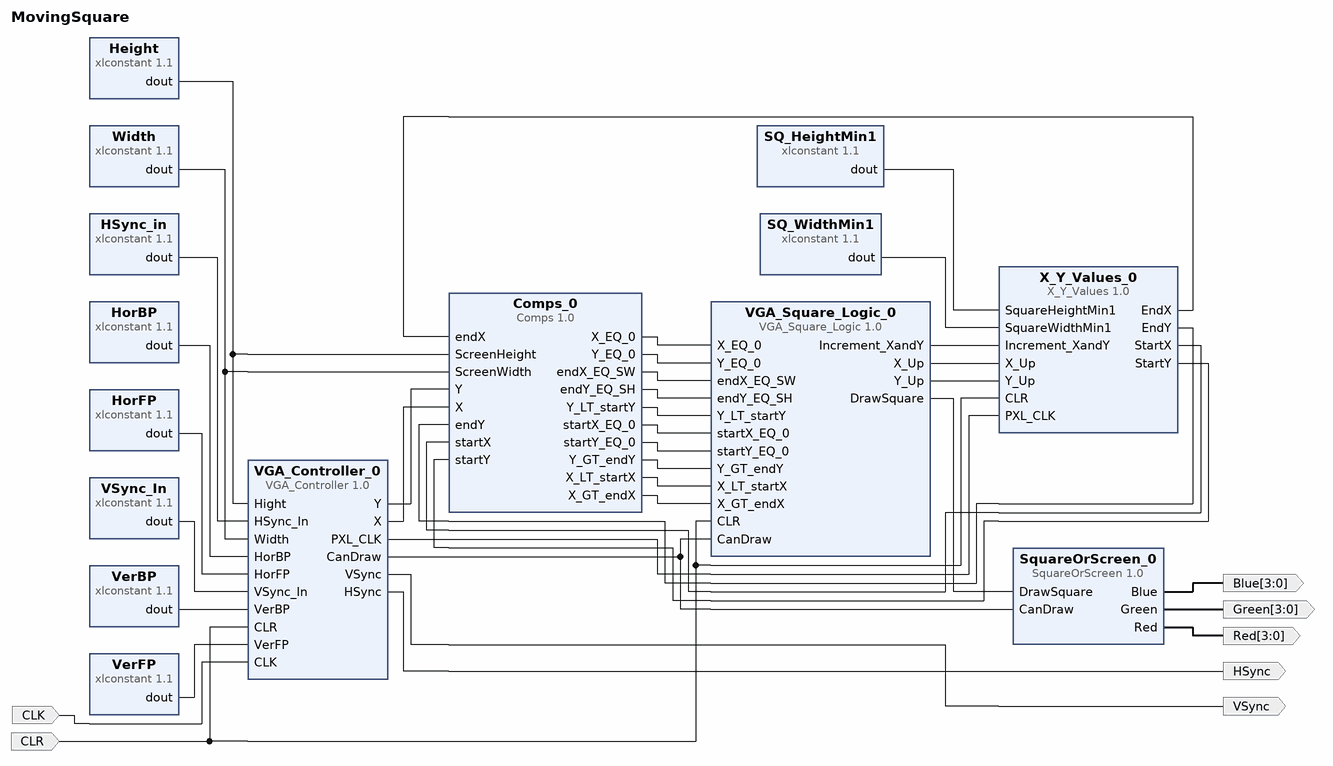
[diagram p0: block diagram of the top level]
# Vivado block design MovingSquare, xc7z020clg400-1, Vivado 2019.2
create_bd_design MovingSquare

create_bd_port -dir I -type clk CLK
set_property -dict {CONFIG.FREQ_HZ 125000000} [get_bd_ports CLK]
create_bd_port -dir I -type rst CLR
set_property -dict {CONFIG.POLARITY ACTIVE_HIGH} [get_bd_ports CLR]
create_bd_port -dir O VSync
create_bd_port -dir O HSync
create_bd_port -dir O -from 3 -to 0 Blue
create_bd_port -dir O -from 3 -to 0 Green
create_bd_port -dir O -from 3 -to 0 Red

create_bd_cell -type ip -vlnv xilinx.com:user:VGA_Controller:1.0 VGA_Controller_0
create_bd_cell -type ip -vlnv xilinx.com:ip:xlconstant:1.1 SQ_HeightMin1
set_property -dict {CONFIG.CONST_VAL 199 CONFIG.CONST_WIDTH 16} [get_bd_cells SQ_HeightMin1]
create_bd_cell -type ip -vlnv xilinx.com:ip:xlconstant:1.1 SQ_WidthMin1
set_property -dict {CONFIG.CONST_VAL 199 CONFIG.CONST_WIDTH 16} [get_bd_cells SQ_WidthMin1]
create_bd_cell -type ip -vlnv xilinx.com:ip:xlconstant:1.1 HSync_in
set_property -dict {CONFIG.CONST_VAL 80 CONFIG.CONST_WIDTH 16} [get_bd_cells HSync_in]
create_bd_cell -type ip -vlnv xilinx.com:ip:xlconstant:1.1 Height
set_property -dict {CONFIG.CONST_VAL 720 CONFIG.CONST_WIDTH 16} [get_bd_cells Height]
create_bd_cell -type ip -vlnv xilinx.com:ip:xlconstant:1.1 HorBP
set_property -dict {CONFIG.CONST_VAL 216 CONFIG.CONST_WIDTH 16} [get_bd_cells HorBP]
create_bd_cell -type ip -vlnv xilinx.com:ip:xlconstant:1.1 HorFP
set_property -dict {CONFIG.CONST_VAL 72 CONFIG.CONST_WIDTH 16} [get_bd_cells HorFP]
create_bd_cell -type ip -vlnv xilinx.com:ip:xlconstant:1.1 VSync_In
set_property -dict {CONFIG.CONST_VAL 5 CONFIG.CONST_WIDTH 16} [get_bd_cells VSync_In]
create_bd_cell -type ip -vlnv xilinx.com:ip:xlconstant:1.1 VerBP
set_property -dict {CONFIG.CONST_VAL 22 CONFIG.CONST_WIDTH 16} [get_bd_cells VerBP]
create_bd_cell -type ip -vlnv xilinx.com:ip:xlconstant:1.1 VerFP
set_property -dict {CONFIG.CONST_VAL 3 CONFIG.CONST_WIDTH 16} [get_bd_cells VerFP]
create_bd_cell -type ip -vlnv xilinx.com:ip:xlconstant:1.1 Width
set_property -dict {CONFIG.CONST_VAL 1280 CONFIG.CONST_WIDTH 16} [get_bd_cells Width]
create_bd_cell -type ip -vlnv xilinx.com:user:Comps:1.0 Comps_0
create_bd_cell -type ip -vlnv xilinx.com:user:SquareOrScreen:1.0 SquareOrScreen_0
create_bd_cell -type ip -vlnv xilinx.com:user:X_Y_Values:1.0 X_Y_Values_0
create_bd_cell -type ip -vlnv xilinx.com:user:VGA_Square_Logic:1.0 VGA_Square_Logic_0

# ---- connections ----

connect_bd_net [get_bd_ports CLK] [get_bd_pins VGA_Controller_0/CLK]
connect_bd_net [get_bd_ports CLR] [get_bd_pins VGA_Controller_0/CLR] [get_bd_pins X_Y_Values_0/CLR] [get_bd_pins VGA_Square_Logic_0/CLR]
connect_bd_net [get_bd_pins VGA_Controller_0/PXL_CLK] [get_bd_pins X_Y_Values_0/PXL_CLK]
connect_bd_net -net SQ_Height_dout [get_bd_pins SQ_HeightMin1/dout] [get_bd_pins X_Y_Values_0/SquareHeightMin1]
connect_bd_net -net SQ_WidthPlus1_dout [get_bd_pins SQ_WidthMin1/dout] [get_bd_pins X_Y_Values_0/SquareWidthMin1]
connect_bd_net [get_bd_pins X_Y_Values_0/EndX] [get_bd_pins Comps_0/endX]
connect_bd_net [get_bd_pins X_Y_Values_0/EndY] [get_bd_pins Comps_0/endY]
connect_bd_net [get_bd_pins X_Y_Values_0/StartX] [get_bd_pins Comps_0/startX]
connect_bd_net [get_bd_pins X_Y_Values_0/StartY] [get_bd_pins Comps_0/startY]
connect_bd_net [get_bd_pins VGA_Controller_0/Y] [get_bd_pins Comps_0/Y]
connect_bd_net [get_bd_pins VGA_Controller_0/X] [get_bd_pins Comps_0/X]
connect_bd_net [get_bd_pins VGA_Controller_0/VSync] [get_bd_ports VSync]
connect_bd_net [get_bd_pins VGA_Controller_0/HSync] [get_bd_ports HSync]
connect_bd_net [get_bd_pins HSync_in/dout] [get_bd_pins VGA_Controller_0/HSync_In]
connect_bd_net [get_bd_pins Height/dout] [get_bd_pins VGA_Controller_0/Hight] [get_bd_pins Comps_0/ScreenHeight]
connect_bd_net [get_bd_pins Width/dout] [get_bd_pins VGA_Controller_0/Width] [get_bd_pins Comps_0/ScreenWidth]
connect_bd_net [get_bd_pins HorBP/dout] [get_bd_pins VGA_Controller_0/HorBP]
connect_bd_net [get_bd_pins HorFP/dout] [get_bd_pins VGA_Controller_0/HorFP]
connect_bd_net [get_bd_pins VSync_In/dout] [get_bd_pins VGA_Controller_0/VSync_In]
connect_bd_net [get_bd_pins VerBP/dout] [get_bd_pins VGA_Controller_0/VerBP]
connect_bd_net [get_bd_pins VerFP/dout] [get_bd_pins VGA_Controller_0/VerFP]
connect_bd_net [get_bd_pins Comps_0/X_EQ_0] [get_bd_pins VGA_Square_Logic_0/X_EQ_0]
connect_bd_net [get_bd_pins Comps_0/Y_EQ_0] [get_bd_pins VGA_Square_Logic_0/Y_EQ_0]
connect_bd_net [get_bd_pins VGA_Controller_0/CanDraw] [get_bd_pins SquareOrScreen_0/CanDraw] [get_bd_pins VGA_Square_Logic_0/CanDraw]
connect_bd_net -net Comps_0_X_EQ_SW [get_bd_pins Comps_0/endX_EQ_SW] [get_bd_pins VGA_Square_Logic_0/endX_EQ_SW]
connect_bd_net -net Comps_0_Y_EQ_SH [get_bd_pins Comps_0/endY_EQ_SH] [get_bd_pins VGA_Square_Logic_0/endY_EQ_SH]
connect_bd_net [get_bd_pins Comps_0/Y_LT_startY] [get_bd_pins VGA_Square_Logic_0/Y_LT_startY]
connect_bd_net [get_bd_pins Comps_0/startX_EQ_0] [get_bd_pins VGA_Square_Logic_0/startX_EQ_0]
connect_bd_net [get_bd_pins Comps_0/startY_EQ_0] [get_bd_pins VGA_Square_Logic_0/startY_EQ_0]
connect_bd_net [get_bd_pins Comps_0/Y_GT_endY] [get_bd_pins VGA_Square_Logic_0/Y_GT_endY]
connect_bd_net [get_bd_pins Comps_0/X_LT_startX] [get_bd_pins VGA_Square_Logic_0/X_LT_startX]
connect_bd_net [get_bd_pins Comps_0/X_GT_endX] [get_bd_pins VGA_Square_Logic_0/X_GT_endX]
connect_bd_net [get_bd_pins VGA_Square_Logic_0/DrawSquare] [get_bd_pins SquareOrScreen_0/DrawSquare]
connect_bd_net [get_bd_pins VGA_Square_Logic_0/Increment_XandY] [get_bd_pins X_Y_Values_0/Increment_XandY]
connect_bd_net [get_bd_pins VGA_Square_Logic_0/X_Up] [get_bd_pins X_Y_Values_0/X_Up]
connect_bd_net [get_bd_pins VGA_Square_Logic_0/Y_Up] [get_bd_pins X_Y_Values_0/Y_Up]
connect_bd_net [get_bd_pins SquareOrScreen_0/Blue] [get_bd_ports Blue]
connect_bd_net [get_bd_pins SquareOrScreen_0/Green] [get_bd_ports Green]
connect_bd_net [get_bd_pins SquareOrScreen_0/Red] [get_bd_ports Red]

validate_bd_design
save_bd_design
